# EAGLE schematic IMD_BMS (EAGLE 9.6.2)
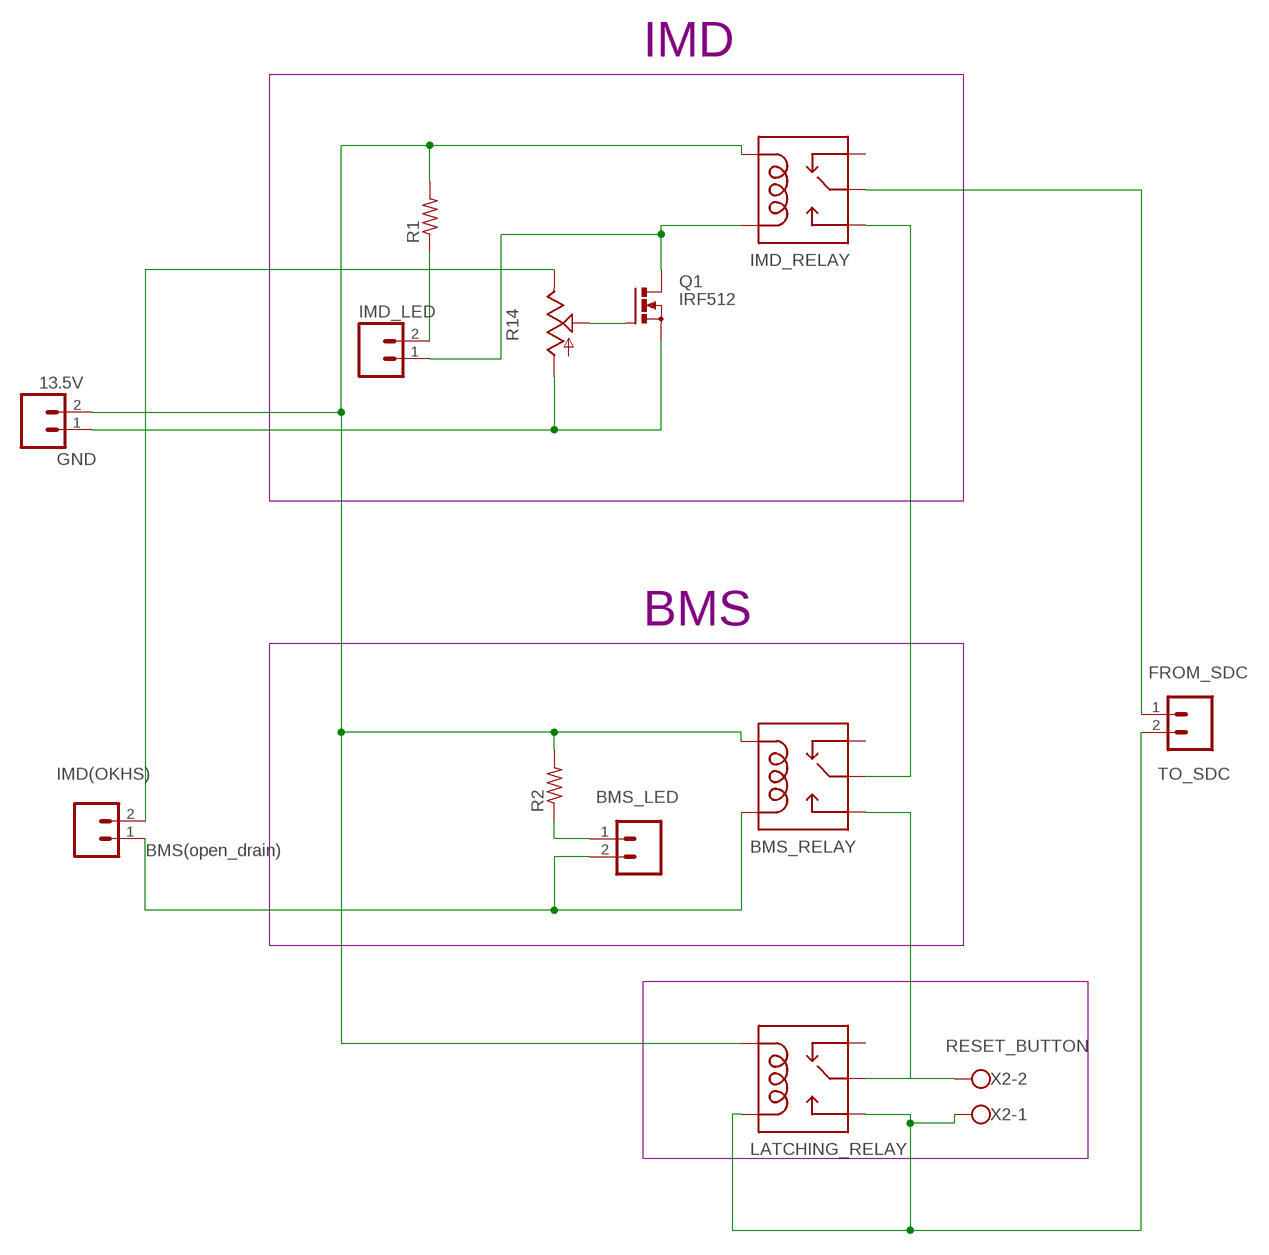
[diagram p0: schematic, sheet 1]

## Parts
13.5V  GND  M02  [02P]
BMS_LED  M02  [02P]
FROM_SDC  TO_SDC  M02  [02P]
IMD(OKHS)  BMS(open_drain)  M02  [02P]
IMD_LED  M02  [02P]
K1  BMS_RELAY  RELAY-SPDT  [RELAY_G5LE]
K2  LATCHING_RELAY  RELAY-SPDT  [RELAY_G5LE]
K3  IMD_RELAY  RELAY-SPDT  [RELAY_G5LE]
Q1  IRF512  [TO220BV]
R1  R-US_0204/5  [0204/5]
R2  R-US_0204/5  [0204/5]
R14  TRIM_US-B25P  [B25P]
X2  W237-102  [W237-102]

## Nets
N$1: FROM_SDC.1 K3.1(MAIN)
N$2: K1.1(MAIN) K3.3(NO)
N$3: BMS_LED.2 IMD(OKHS).1 K1.5(COIL2)
N$4: FROM_SDC.2 K2.3(NO) K2.5(COIL2) X2.1
N$5: 13.5V.2 K1.2(COIL1) K2.2(COIL1) K3.2(COIL1) R1.2 R2.2
N$6: IMD_LED.1 K3.5(COIL2) Q1.D
N$7: 13.5V.1 Q1.S R14.A
N$8: Q1.G R14.S
N$9: IMD(OKHS).2 R14.E
N$10: BMS_LED.1 R2.1
N$11: IMD_LED.2 R1.1
RESET_BUTTON: K1.3(NO) K2.1(MAIN) X2.2
Unconnected: K1.4(NC) K2.4(NC) K3.4(NC)

## Notes on the sheet
- IMD
- BMS

## Library data of the parts
13.5V BMS_LED FROM_SDC IMD(OKHS) IMD_LED = con-amp-quick:M02: AMP QUICK CONNECTOR; OC_FARNELL: unknown; OC_NEWARK: unknown
K1-K3 = SparkFun-Electromechanical:RELAY-SPDT: SPDT Electromechanical Relay Single-pole, double-throw sealed relays. When current is applied to the coil, it throws a simple changeover switch, terminating the connection from the NC contact to ground and closing the NO contact. Use them to switch high voltage/high current devices. SparkFun Products JQX-15F: Relay SPDT Sealed - 20A <https://www.sparkfun.com/products/10924> (COM-10924) JZC-11F: Relay SPDT Sealed <https://www.sparkfun.com/products/100> (COM-00100); PROD_ID: COMP-14214
Q1 = transistor-power:IRF512: N-CHANNEL MOS FET
R1 R2 = rcl:R-US_: RESISTOR, American symbol; SPICEPREFIX: R
R14 = pot:TRIM_US-: POTENTIOMETER
X2 = con-wago-500:W237-102: WAGO SCREW CLAMP; MPN: 237-102; OC_FARNELL: unknown; OC_NEWARK: 70K9898